# Altium schematic sheet Schematics.SchDoc
size A4
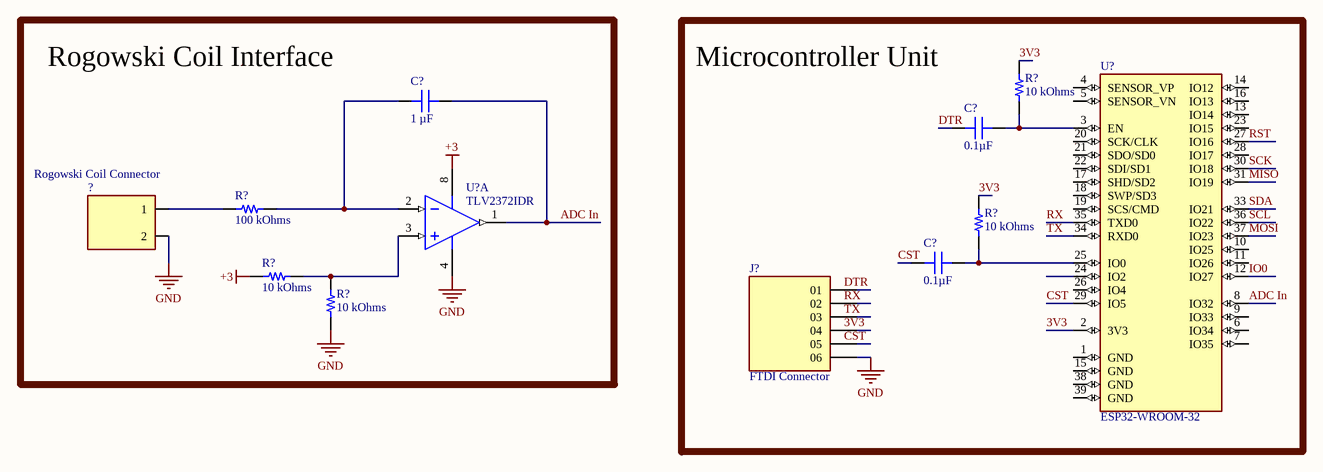
[diagram p0: Schematics.SchDoc]

## Parts
(Parts that share a designator on the sheet are numbered #1, #2 ... from top to bottom, then left to right.)
?  Rogowski Coil Connector  [SM4-CON]
C?#1  1 µF  [CAP 0603_1608]
C?#2  0.1µF  [CAP 0603_1608]
C?#3  0.1µF  [CAP 0603_1608]
J?  FTDI Connector  [SAMTEC_MTSW-106-09-G-S-375-RA]
R?#1  10 kOhms  [RES 0603_1608]
R?#2  100 kOhms  [RES 0603_1608]
R?#3  10 kOhms  [RES 0603_1608]
R?#4  10 kOhms  [RES 0603_1608]
R?#5  10 kOhms  [RES 0603_1608]
U?#1  TLV2372IDR  [D0008A_M]  (part A of 2)
U?#2  ESP32-WROOM-32  [ESP32-WROOM-32]

## Blocks framed on the sheet
Rogowski Coil Interface: ? C?#1 R?#2 R?#4 R?#5 U?#1
Microcontroller Unit: C?#2 C?#3 J? R?#1 R?#3 U?#2

## Nets
+3: R?#4.1 U?#1.8(VDD)
GND: ?.2 J?.06 R?#5.1 U?#1.4(GND)
3V3: R?#1.2 R?#3.2 U?#2.2(3V3)
ADC In: C?#1.2 U?#1.1(OUT1) U?#2.8(IO32)
CST: C?#3.1 U?#2.29(IO5)
DTR: C?#2.1
IO0: U?#2.12(IO27)
MISO: U?#2.31(IO19)
MOSI: U?#2.37(IO23)
RST: U?#2.27(IO16)
RX: U?#2.35(TXD0)
SCK: U?#2.30(IO18)
SCL: U?#2.36(IO22)
SDA: U?#2.33(IO21)
TX: U?#2.34(RXD0)
Net?_1: ?.1 R?#2.1
NetC?#1_1: C?#1.1 R?#2.2 U?#1.2(IN1-)
NetC?#2_2: C?#2.2 R?#1.1 U?#2.3(EN)
NetC?#3_2: C?#3.2 R?#3.1 U?#2.25(IO0)
NetR?#4_2: R?#4.2 R?#5.2 U?#1.3(IN1+)

Not connected (* = marked no-connect by the designer): J? 01 02 03 04 05; U?#2 1(GND) 4(SENSOR_VP) 5(SENSOR_VN) 6(IO34) 7(IO35) 9(IO33) 10(IO25) 11(IO26) 13(IO14) 14(IO12) 15(GND) 16(IO13) 17(SHD/SD2) 18(SWP/SD3) 19(SCS/CMD) 20(SCK/CLK) 21(SDO/SD0) 22(SDI/SD1) 23(IO15) 24(IO2) 26(IO4) 28(IO17) 38(GND) 39(GND)

## Notes on the sheet
- Labels drawn without touching a wire or pin: 3V3, CST, DTR, RX, TX

## Library data of the parts
? = B2B-PH-SM4-TB(LF)(SN): Connector Header Surface Mount 2 position 0.079 (2.00mm); MF: JST Sales; SnapEDA_Link: https://www.snapeda.com/parts/B2B-PH-SM4-TB(LF)(SN)/JST+Sales+America+Inc./view-part/?ref=snap; Package: NON STANDARD-2 JST; Value: *; MP: B2B-PH-SM4-TB(LF)(SN); Check_prices: https://www.snapeda.com/parts/B2B-PH-SM4-TB(LF)(SN)/JST+Sales+America+Inc./view-part/?ref=eda
C?#1 = C0603X105M9RACAUTO: CAP CER 1UF 6.3V X7R 0603; manufacturer: KEMET; Tolerance: ±20%; Part Number: C0603X105M9RACAUTO; Capacitance: 1 µF; Applications: Automotive, Boardflex Sensitive; componentlink1description: Datasheet; componentlink1url: https://api.kemet.com/component-edge/download/datasheet/C0603X105M9RACAUTO.pdf; componentlink2description: DigiKey Link; componentlink2url: https://www.digikey.com/en/products/detail/kemet/C0603X105M9RACAUTO/8635848; Device Package: 0603 (1608 Metric); Features: Soft Termination; lastupdated: 09/02/2024 8:10:30 pm; Lifecycle Status: Active; Minimum Order: 1; Mounting Type: Surface Mount, MLCC; Operating Temperature: -55°C ~ 125°C; Package / Case: 0603 (1608 Metric); packaging: TapeAndReel; partid: 2401; Part Status: Active; price: 0.06; Ratings: AEC-Q200; series: SMD Auto X7R Flex; Size / Dimension: 0.063" L x 0.031" W (1.60mm x 0.80mm); Supplier 1: DigiKey; Supplier Part Number 1: 399-17721-1-ND; Temperature Coefficient: X7R; Thickness (Max): 0.037" (0.95mm); value: 1 µF; Voltage - Rated: 6.3V
C?#2 C?#3 = 06033C104K4T4A: CAP CER 0.1UF 25V X7R 0603; manufacturer: AVX Corporation; Tolerance: ±10%; Part Number: 06033C104K4T4A; Capacitance: 0.1µF; Applications: Automotive; componentlink1description: Datasheet; componentlink1url: http://datasheets.avx.com/AutoMLCC.pdf; componentlink2description: DigiKey Link; componentlink2url: http://digikey.com/product-detail/en/avx-corporation/06033C104K4T4A/478-10673-1-ND/7536544; Device Package: 0603 (1608 Metric); lastupdated: 02/09/2020 1:03:35 am; Lifecycle Status: Active; Minimum Order: 1; Mounting Type: Surface Mount, MLCC; Operating Temperature: -55°C ~ 125°C; Package / Case: 0603 (1608 Metric); packaging: TapeAndReel; partid: 2749; Part Status: Active; price: 0.02; Ratings: AEC-Q200; series: -; Size / Dimension: 0.063" L x 0.032" W (1.60mm x 0.81mm); Supplier 1: DigiKey; Supplier Part Number 1: 478-10673-1-ND; Temperature Coefficient: X7R; Thickness (Max): 0.035" (0.90mm); value: 0.1µF; Voltage - Rated: 25V
J? = MTSW-106-09-G-S-375-RA: Connector Header Through Hole, Right Angle 6 position 0.100 (2.54mm); MF: Samtec Inc.; SnapEDA_Link: https://www.snapeda.com/parts/MTSW-106-09-G-S-375-RA/Samtec/view-part/?ref=snap; Package: None; Value: *; MP: MTSW-106-09-G-S-375-RA; Check_prices: https://www.snapeda.com/parts/MTSW-106-09-G-S-375-RA/Samtec/view-part/?ref=eda
R?#1 R?#3-R?#5 = CRCW060310K0JNEA: RES SMD 10K OHM 5% 1/10W 0603; Manufacturer: Vishay Dale; Power (Watts): 0.1W, 1/10W; Temperature Coefficient: ±200ppm/°C; Part Number: CRCW060310K0JNEA; Value: 10 kOhms; ComponentLink1Description: Datasheet; ComponentLink1URL: http://www.vishay.com/docs/20035/dcrcwe3.pdf; ComponentLink2Description: DigiKey Link; ComponentLink2URL: https://www.digikey.com/en/products/detail/vishay-dale/CRCW060310K0JNEA/1174253; Composition: Thick Film; Device Package: 0603 (1608 Metric); Features: Automotive AEC-Q200; Height - Seated (Max): 0.020" (0.50mm); LastUpdated: 09/02/2024 8:43:35 pm; Lifecycle Status: Active; Minimum Order: 1; Number of Terminations: 2; Operating Temperature: -55°C ~ 155°C; Package / Case: 0603 (1608 Metric); Packaging: CutTape; PartId: 5216; Part Status: Active; Price: 0.01; Ratings: AEC-Q200; Resistance: 10 kOhms; Series: CRCW; Size / Dimension: 0.063" L x 0.033" W (1.60mm x 0.85mm); Supplier 1: DigiKey; Supplier Part Number 1: 541-10KGCT-ND; Supplier Device Package: 0603; Tolerance: ±5%
R?#2 = RNCS0603BKE100K: RES 100K OHM 0.1% 1/16W 0603; Manufacturer: Stackpole Electronics Inc; Power (Watts): 0.063W, 1/16W; Temperature Coefficient: ±25ppm/°C; Part Number: RNCS0603BKE100K; Value: 100 kOhms; ComponentLink1Description: Datasheet; ComponentLink1URL: https://www.seielect.com/catalog/sei-rncs_rnch.pdf; ComponentLink2Description: DigiKey Link; ComponentLink2URL: https://www.digikey.com/en/products/detail/stackpole-electronics-inc/RNCS0603BKE100K/1708835; Composition: Thin Film; Device Package: 0603 (1608 Metric); Features: Anti-Corrosive, Automotive AEC-Q200, Moisture Resistant; Height - Seated (Max): 0.022" (0.55mm); LastUpdated: 09/02/2024 8:43:37 pm; Lifecycle Status: Active; Minimum Order: 1; Number of Terminations: 2; Operating Temperature: -55°C ~ 155°C; Package / Case: 0603 (1608 Metric); Packaging: TapeAndReel; PartId: 4849; Part Status: Active; Price: 0.06; Ratings: AEC-Q200; Resistance: 100 kOhms; Series: RNCS; Size / Dimension: 0.061" L x 0.031" W (1.55mm x 0.80mm); Supplier 1: DigiKey; Supplier Part Number 1: RNCS0603BKE100KCT-ND; Supplier Device Package: 0603; Tolerance: ±0.1%
U?#1 = CMP-0272-02948-3: 550 uA/Ch, 3 MHz, RRIO Operational Amplifier, 2.7 to 16 V, -40 to 125 degC, 8-pin SOIC (D8), Green (RoHS & no Sb/Br); Manufacturer: Texas Instruments; GBW(Typ)(MHz): 3; Offset Drift(Typ)(uV/C): 2; Total Supply Voltage(Max)(+5V is 5, +/-5V is 10): 16; Vio (25C)(Max)(mV): 4.5; Iq per channel(Max)(mA): 0.9; Packing: LARGE T&R; Sub Family: Low Supply Voltage Amplifier (<=2.7V), Precision Amplifier; IIB(Max)(pA): 60; Rating: Catalog; CMRR(Min)(dB): 50; Total Supply Voltage(Min)(+5V is 5, +/-5V is 10): 2.7; Slew Rate(Typ)(V/us): 2.4; ComponentLink1URL: http://www.ti.com/; ComponentLink2Description: Datasheet; PartNumber: TLV2372IDR; Code_JEDEC: MS-012; PackageDescription: 8-Pin Plastic Small Outline, Body 4.9 x 3.9 mm, Pitch 1.27 mm; ComponentLink1Description: Manufacturer URL; DatasheetVersion: SLOS270D; ComponentLink3Description: Package Specification; ComponentLink2URL: http://www.ti.com/lit/ds/symlink/tlv2372.pdf; ComponentLink3URL: http://www.ti.com/litv/pdf/msoi002j; Mounting Technology: Surface Mount; PackageVersion: 4040047-3/M, 06/2011; Eco-Plan: Green (RoHS & no Sb/Br); Number of Channels: 2; PackageReference: D0008A
U?#2 = ESP32-WROOM-32: RX TXRX MOD WIFI TRACE ANT SMD; MF: Espressif Systems; MP: ESP32WROOM32; SnapEDA_Link: https://www.snapeda.com/parts/ESP32WROOM32/Espressif+Systems/view-part/?ref=snap; Package: None; Value: *; Check_prices: https://www.snapeda.com/parts/ESP32WROOM32/Espressif+Systems/view-part/?ref=eda